# EAGLE design MSPIDAC (EAGLE 5.04)
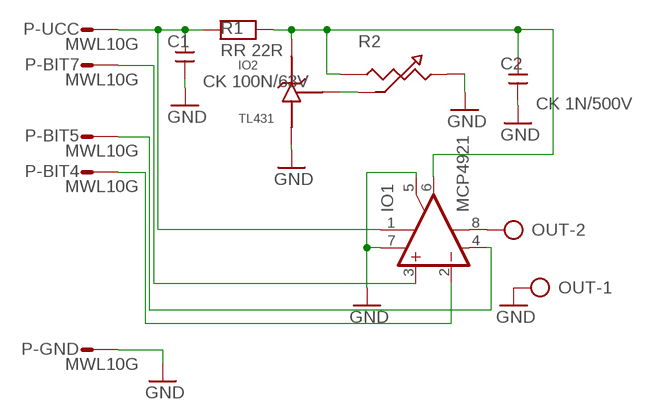
[diagram p0: schematic, sheet 1]

## Parts
C1  CK 100N/63V  C5  [C-5]
C2  CK 1N/500V  C5  [C-5]
IO1  MCP4921  TL061P  [DIL08]
IO2  TL431  [SOT54A]
OUT  AK500/2  [AK500/2]
P  MWL10G  PSL10MLW10G  [MLW10G]
R1  RR 22R  R10  [R-10]
R2  RESVAR  [PT-10]

## Nets
GND: C1.2 C2.2 IO1.5(ON2) IO1.7(V+) IO2.B OUT.1 P.10 R2.2
N$1: C1.1 IO1.1(ON1) P.1 R1.1
N$2: C2.1 IO1.6(OUT) IO2.E R1.2 R2.1
N$3: IO2.C R2.3
N$4: IO1.8(OPT) OUT.2
N$5: IO1.4(V-) P.4
N$6: IO1.2(-IN) P.5
N$7: IO1.3(+IN) P.2
Unconnected: P.3 P.6 P.7 P.8 P.9

## Library data of the parts
C1 C2 = !moje:C5
IO1 = !moje:TL061: OP AMP
IO2 = !moje:TL431
OUT = con-ptr500:AK500/2: CONNECTOR
P = !moje:PSL10: CONNECTOR
R1 = !moje:R10
R2 = discrete:RESVAR

## Board
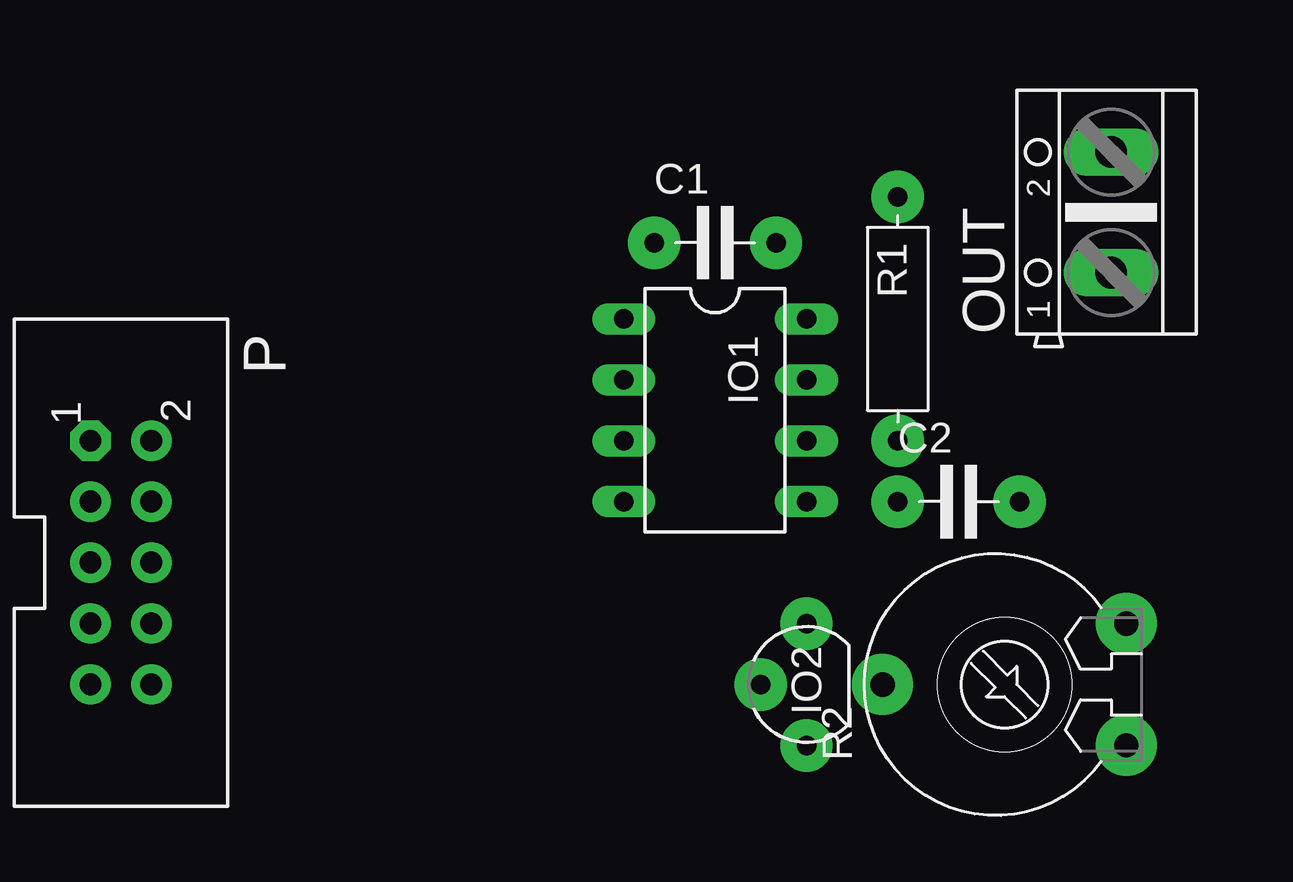
[diagram p1: board, top side]
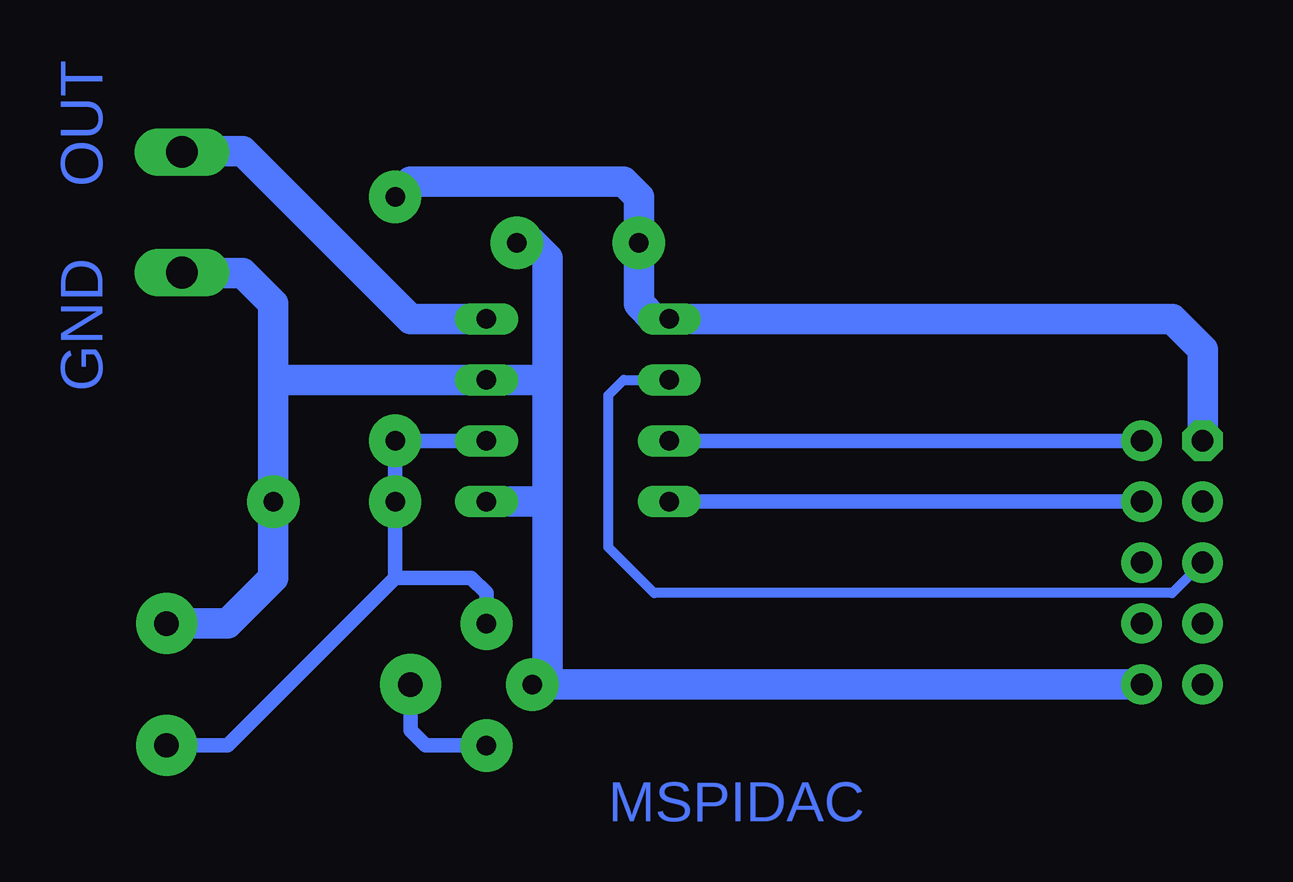
[diagram p2: board, bottom side, seen from below]

No outline drawn. Coordinates in mm, seen from the top.
Copper layers (1*16): Top 0.035mm / dielectric 1.5mm / Bottom 0.035mm
Design rules "default *": minimum track width 10mil, minimum drill 24mil, track to track 8mil, track to pad 8mil, pad to pad 8mil, via to via 8mil, smd to smd 8mil, copper to edge 40mil, drill to drill 8mil, minimum pad ring 10mil, minimum via ring 8mil, stop-mask expansion 4mil, vias tented up to drill 0mil, thermal gap 10mil

### Footprints (pad centres in the part's own frame; a part is rotated, then mirrored left to right if it is on the bottom)
C-5 = drill 0.813 pad 2.184 round: 1 -2.54,0; 2 2.54,0
DIL08 = drill 0.813 long: 1 -3.81,-3.81; 2 -1.27,-3.81; 3 1.27,-3.81; 4 3.81,-3.81; 5 3.81,3.81; 6 1.27,3.81; 7 -1.27,3.81; 8 -3.81,3.81
SOT54A = drill 0.813 pad 2.184 round: B 0,1.905; C -2.54,0; E 2.54,0
AK500/2 = drill 1.321 long: 1 -2.515,0; 2 2.515,0
MLW10G = drill 0.914 pad 1.676 octagon: 1 -5.08,-1.27 | drill 0.914 pad 1.676 round: 2 -5.08,1.27; 3 -2.54,-1.27; 4 -2.54,1.27; 5 0,-1.27; 6 0,1.27; 7 2.54,-1.27; 8 2.54,1.27; 9 5.08,-1.27; 10 5.08,1.27
R-10 = drill 0.813 pad 2.184 round: 1 -5.08,0; 2 5.08,0
PT-10 = drill 1.016 pad 2.54 round: 1 -2.54,-5.08; 2 2.54,-5.08; 3 0,5.08

### Placement (x,y rotation side)
C1  29.84,24.13 0 top
C2  40.01,13.34 0 top
IO1  29.84,17.14 270 top
IO2  33.66,5.71 90 top
OUT  46.35,25.4 90 top
P  5.08,10.79 270 top
R1  37.47,20.95 270 top
R2  41.91,5.71 90 top

### Tracks (layer width: path | path; a pad name or v marks a point on that pad's centre or on a via)
GND
  Bottom 1.27: C1.2 31.75,24.13 31.11,23.5 31.11,18.41 | 31.11,18.41 IO1.7 42.55,18.41 | 31.11,13.34 31.11,18.41 | 31.11,13.34 IO1.5 | P.10 IO2.B 31.11,5.71 31.11,13.34 | 42.55,18.41 C2.2 42.55,10.16 44.45,8.26 R2.2 | 42.55,18.41 42.55,21.59 43.81,22.86 46.33,22.86 OUT.1
N$1
  Bottom 1.27: P.1 3.81,19.68 5.08,20.95 IO1.1 26.67,20.95 27.3,21.59 C1.1 27.3,26.04 27.94,26.67 36.83,26.67 R1.1
N$2
  Bottom 0.61: IO1.6 R1.2 C2.1 37.47,10.16 | 37.47,10.16 44.45,3.17 R2.1 | IO2.E 33.66,9.53 34.29,10.16 37.47,10.16
N$3
  Bottom 0.61: IO2.C 36.2,3.17 36.83,3.81 R2.3
N$4
  Bottom 1.27: IO1.8 36.83,20.95 43.81,27.94 46.33,27.94 OUT.2
N$5
  Bottom 0.61: P.4 IO1.4
N$6
  Bottom 0.406: P.5 5.08,9.53 26.67,9.53 28.57,11.43 28.57,17.78 27.94,18.41 IO1.2 25.4,18.41
N$7
  Bottom 0.61: P.2 IO1.3

### Text on the board
Bottom: OUT | GND | MSPIDAC